# EAGLE schematic vocore-v1.0 (EAGLE 7.2.0)
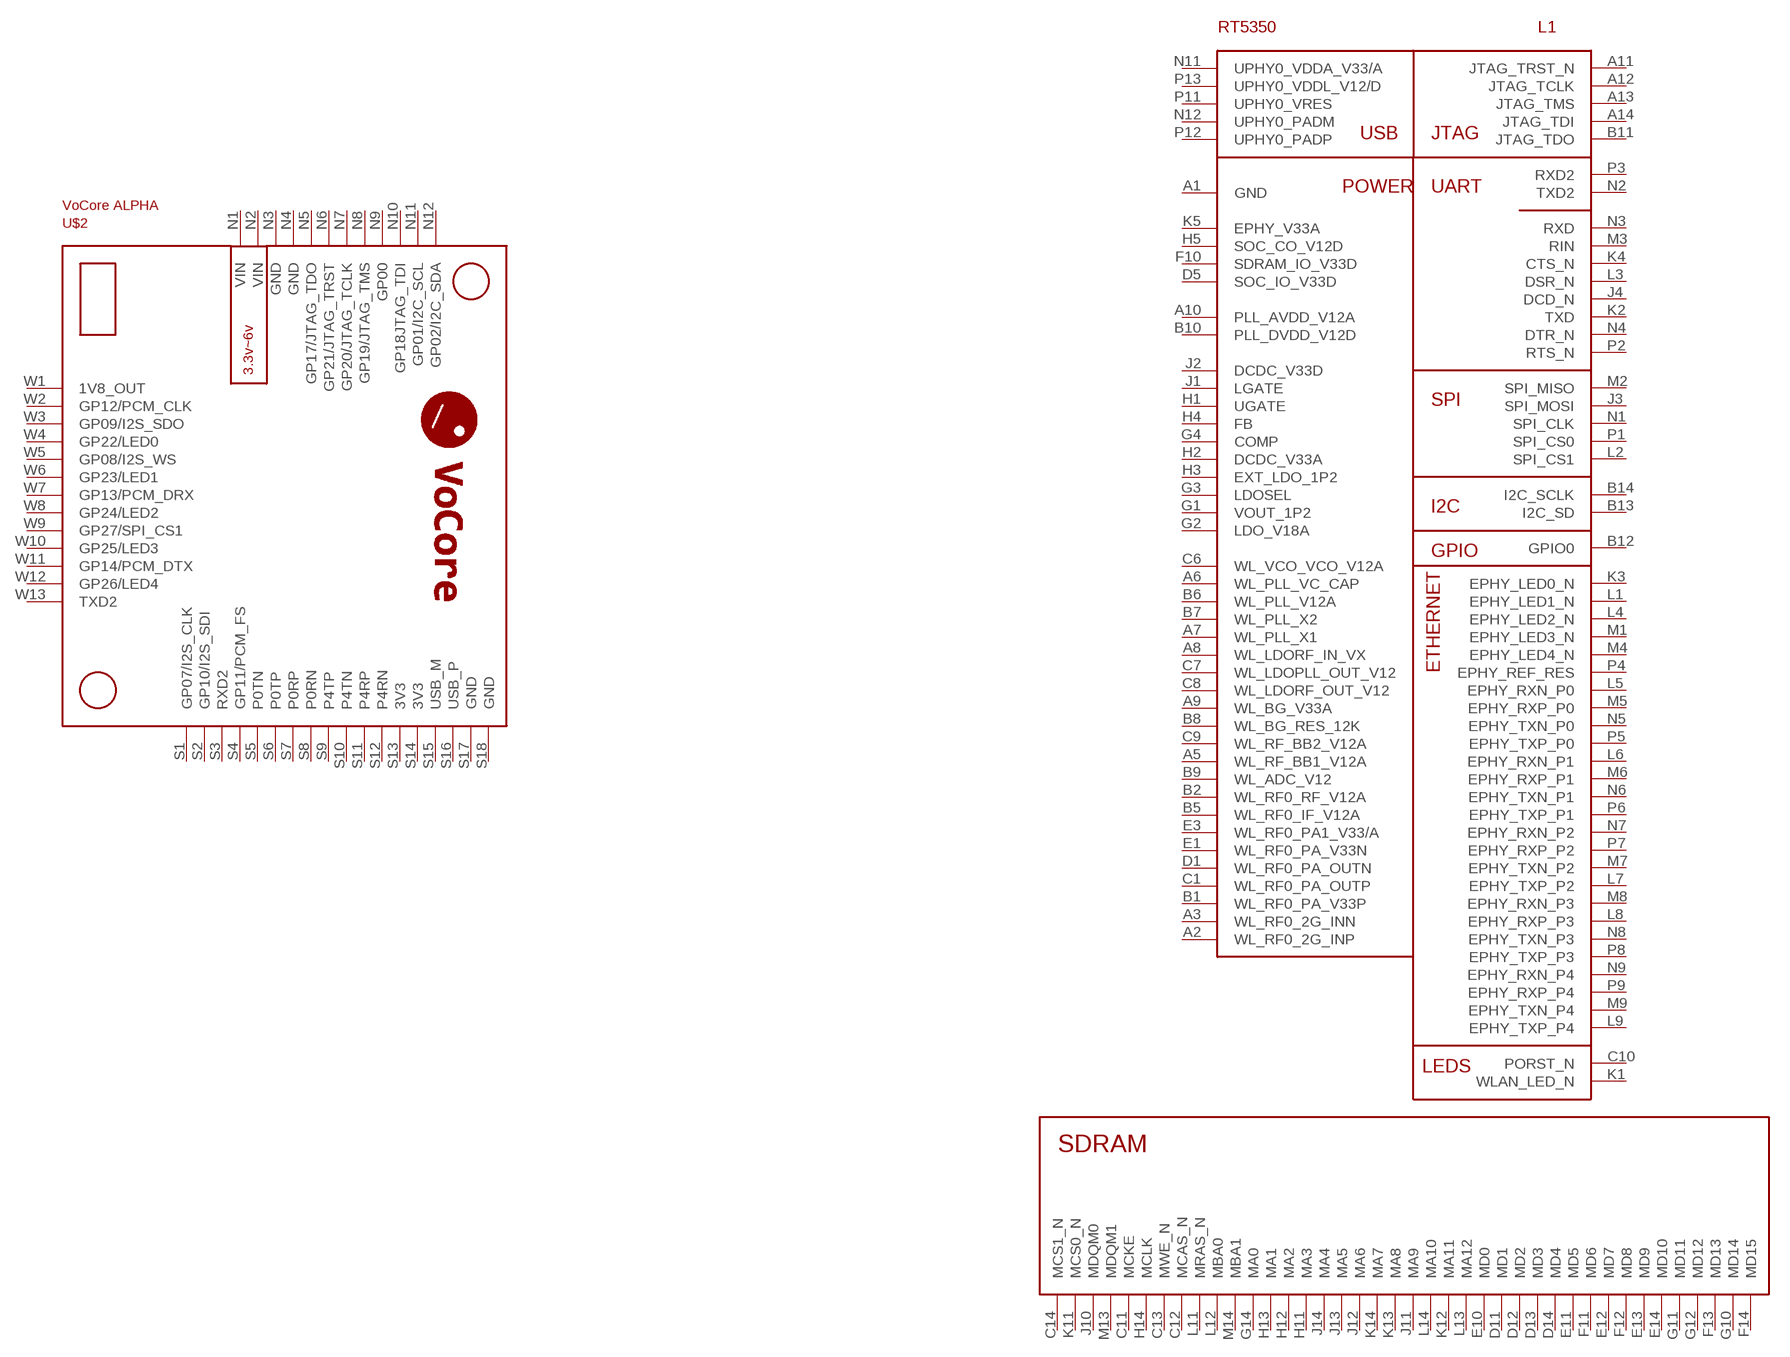
[diagram p0: schematic, sheet 1]

## Parts
L1  RT5350FTFBGA196  [TFBGA196_1PRIMARY]
U$2  VOCORE_V10A  [VOCORE_V10A]
Unconnected: L1.A1(GND) L1.A2(WL_RF0_2G_INP) L1.A3(WL_RF0_2G_INN) L1.A5(WL_RF_BB1_V12A) L1.A6(WL_PLL_VC_CAP) L1.A7(WL_PLL_X1) L1.A8(WL_LDORF_IN_VX) L1.A9(WL_BG_V33A) L1.A10(PLL_AVDD_V12A) L1.A11(JTAG_TRST_N) L1.A12(JTAG_TCLK) L1.A13(JTAG_TMS) L1.A14(JTAG_TDI) L1.B1(WL_RF0_PA_V33P) L1.B2(WL_RF0_RF_V12A) L1.B5(WL_RF0_IF_V12A) L1.B6(WL_PLL_V12A) L1.B7(WL_PLL_X2) L1.B8(WL_BG_RES_12K) L1.B9(WL_ADC_V12) L1.B10(PLL_DVDD_V12D) L1.B11(JTAG_TDO) L1.B12(GPIO0) L1.B13(I2C_SD) L1.B14(I2C_SCLK) L1.C1(WL_RF0_PA_OUTP) L1.C6(WL_VCO_VCO_V12A) L1.C7(WL_LDOPLL_OUT_V12) L1.C8(WL_LDORF_OUT_V12) L1.C9(WL_RF_BB2_V12A) L1.C10(PORST_N) L1.C11(MCKE) L1.C12(MCAS_N) L1.C13(MWE_N) L1.C14(MCS1_N) L1.D1(WL_RF0_PA_OUTN) L1.D5(SOC_IO_V33D) L1.D11(MD1) L1.D12(MD2) L1.D13(MD3) L1.D14(MD4) L1.E1(WL_RF0_PA_V33N) L1.E3(WL_RF0_PA1_V33/A) L1.E10(MD0) L1.E11(MD5) L1.E12(MD7) L1.E13(MD9) L1.E14(MD10) L1.F10(SDRAM_IO_V33D) L1.F11(MD6) L1.F12(MD8) L1.F13(MD13) L1.F14(MD15) L1.G1(VOUT_1P2) L1.G2(LDO_V18A) L1.G3(LDOSEL) L1.G4(COMP) L1.G10(MD14) L1.G11(MD11) L1.G12(MD12) L1.G14(MA0) L1.H1(UGATE) L1.H2(DCDC_V33A) L1.H3(EXT_LDO_1P2) L1.H4(FB) L1.H5(SOC_CO_V12D) L1.H11(MA3) L1.H12(MA2) L1.H13(MA1) L1.H14(MCLK) L1.J1(LGATE) L1.J2(DCDC_V33D) L1.J3(SPI_MOSI) L1.J4(DCD_N) L1.J10(MDQM0) L1.J11(MA9) L1.J12(MA6) L1.J13(MA5) L1.J14(MA4) L1.K1(WLAN_LED_N) L1.K2(TXD) L1.K3(EPHY_LED0_N) L1.K4(CTS_N) L1.K5(EPHY_V33A) L1.K11(MCS0_N) L1.K12(MA11) L1.K13(MA8) L1.K14(MA7) L1.L1(EPHY_LED1_N) L1.L2(SPI_CS1) L1.L3(DSR_N) L1.L4(EPHY_LED2_N) L1.L5(EPHY_RXN_P0) L1.L6(EPHY_RXN_P1) L1.L7(EPHY_TXP_P2) L1.L8(EPHY_RXP_P3) L1.L9(EPHY_TXP_P4) L1.L11(MRAS_N) L1.L12(MBA0) L1.L13(MA12) L1.L14(MA10) L1.M1(EPHY_LED3_N) L1.M2(SPI_MISO) L1.M3(RIN) L1.M4(EPHY_LED4_N) L1.M5(EPHY_RXP_P0) L1.M6(EPHY_RXP_P1) L1.M7(EPHY_TXN_P2) L1.M8(EPHY_RXN_P3) L1.M9(EPHY_TXN_P4) L1.M13(MDQM1) L1.M14(MBA1) L1.N1(SPI_CLK) L1.N2(TXD2) L1.N3(RXD) L1.N4(DTR_N) L1.N5(EPHY_TXN_P0) L1.N6(EPHY_TXN_P1) L1.N7(EPHY_RXN_P2) L1.N8(EPHY_TXN_P3) L1.N9(EPHY_RXN_P4) L1.N11(UPHY0_VDDA_V33/A) L1.N12(UPHY0_PADM) L1.P1(SPI_CS0) L1.P2(RTS_N) L1.P3(RXD2) L1.P4(EPHY_REF_RES) L1.P5(EPHY_TXP_P0) L1.P6(EPHY_TXP_P1) L1.P7(EPHY_RXP_P2) L1.P8(EPHY_TXP_P3) L1.P9(EPHY_RXP_P4) L1.P11(UPHY0_VRES) L1.P12(UPHY0_PADP) L1.P13(UPHY0_VDDL_V12/D) U$2.N5(GP17/JTAG_TDO) U$2.N6(GP21/JTAG_TRST) U$2.N7(GP20/JTAG_TCLK) U$2.N8(GP19/JTAG_TMS) U$2.N9(GP00) U$2.N10(GP18JTAG_TDI) U$2.N11(GP01/I2C_SCL) U$2.N12(GP02/I2C_SDA) U$2.S1(GP07/I2S_CLK) U$2.S2(GP10/I2S_SDI) U$2.S3(RXD2) U$2.S4(GP11/PCM_FS) U$2.S5(P0TN) U$2.S6(P0TP) U$2.S7(P0RP) U$2.S8(P0RN) U$2.S9(P4TP) U$2.S10(P4TN) U$2.S11(P4RP) U$2.S12(P4RN) U$2.S13(3V3) U$2.S14(3V3) U$2.S15(USB_M) U$2.S16(USB_P) U$2.W2(GP12/PCM_CLK) U$2.W3(GP09/I2S_SDO) U$2.W4(GP22/LED0) U$2.W5(GP08/I2S_WS) U$2.W6(GP23/LED1) U$2.W7(GP13/PCM_DRX) U$2.W8(GP24/LED2) U$2.W9(GP27/SPI_CS1) U$2.W10(GP25/LED3) U$2.W11(GP14/PCM_DTX) U$2.W12(GP26/LED4) U$2.W13(TXD2)

## Power pins joined to a net without a drawn wire
1V8_OUT: U$2.W1(1V8_OUT)
GND: U$2.N3(GND) U$2.N4(GND) U$2.S17(GND) U$2.S18(GND)
VIN: U$2.N1(VIN) U$2.N2(VIN)

## Library data of the parts
L1 = vocore-v1.0:RT5350F
U$2 = vocore_atom:VOCORE_V10A: VoCore module footprint, revision 1.0a Based on: http://vonger.cn/wp-content/uploads/2014/06/VoCore.v1.0a.pcb_.pdf Found a bug? Get in touch or send a pull request at https://github.com/omerk/vocore-evk